# EAGLE schematic SelfTestWiring (EAGLE 7.6.0)
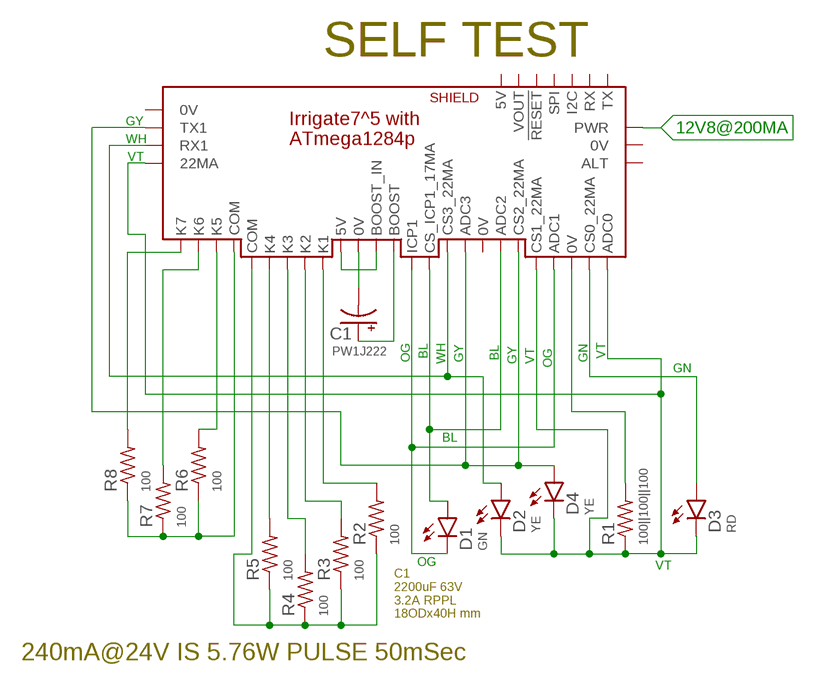
[diagram p0: schematic, sheet 1]

## Parts
C1  PW1J222  C-AL7.5X18  [E7,5-18]
D1  GN  LED5MM  [LED5MM]
D2  YE  LED5MM  [LED5MM]
D3  RD  LED5MM  [LED5MM]
D4  YE  LED5MM  [LED5MM]
R1  100||100||100  R0805  [C0805(2012)]
R2  100  R0805  [C0805(2012)]
R3  100  R0805  [C0805(2012)]
R4  100  R0805  [C0805(2012)]
R5  100  R0805  [C0805(2012)]
R6  100  R0805  [C0805(2012)]
R7  100  R0805  [C0805(2012)]
R8  100  R0805  [C0805(2012)]
U$2  IRRIGATE7  [WITH_RPU_NAMES]

## Nets
12V8@200MA: U$2.PWR
BL: D1.A U$2.17MA@ICP1(CS_ICP1_17MA) U$2.ADC4(ADC2)
GN: D3.A U$2.22MA@ADC0(CS0_22MA)
GY: D4.A U$2.22MA@ADC4(CS2_22MA) U$2.ADC5(ADC3) U$2.DIO3(TX1)
N$1: U$2.5V U$2.BOOST_IN
N$2: R2.2 U$2.K1
N$3: R2.1 R3.1 R4.1 R5.1 U$2.COM@K4(COM)
N$4: R1.2 U$2.0V@ADC2(0V)
N$5: R5.2 U$2.K4
N$6: R4.2 U$2.K3
N$7: R3.2 U$2.K2
N$8: R6.2 U$2.K5
N$9: R6.1 R7.1 R8.1 U$2.COM@K5(COM)
N$10: C1.- U$2.0V
N$11: C1.+ U$2.BOOST
N$12: R7.2 U$2.K6
N$13: R8.2 U$2.K7
OG: D1.K U$2.ADC1 U$2.ICP1
VT: D2.K D3.K D4.K R1.1 U$2.22MA@ADC1(CS1_22MA) U$2.22MA@DIO2(22MA) U$2.ADC0
WH: D2.A U$2.22MA@ADC5(CS3_22MA) U$2.DIO2(RX1)
Unconnected: U$2.0V@PWR(0V) U$2.17MA@ICP3(0V) U$2.!RESET U$2.AUX(ALT) U$2.I2C U$2.ICP3(0V) U$2.RX U$2.SHLD_5V(5V) U$2.SHLD_VOUT(VOUT) U$2.SPI U$2.TX

## Notes on the sheet
- SELF TEST
- C1
  2200uF 63V
  3.2A RPPL
  18ODx40H mm
- 240mA@24V IS 5.76W PULSE 50mSec

## Library data of the parts
C1 = C-Al:C-AL: Aluminum Electrolytic Capacitors PW1J222 [NICHICON,UPW1J222MHD] CAP ALUM 63V 2200UF 20% RADIAL
D1-D4 = D-LED:LED: LED 120120WH [CREE,XHGAWT-00-0000-00000HXE1] LED WHITE 6500K 150LUM-W120120
R1-R8 = R-C:R: Resiistor American-style symbol
U$2 = Documentation:IRRIGATE7: BM /w 1284p